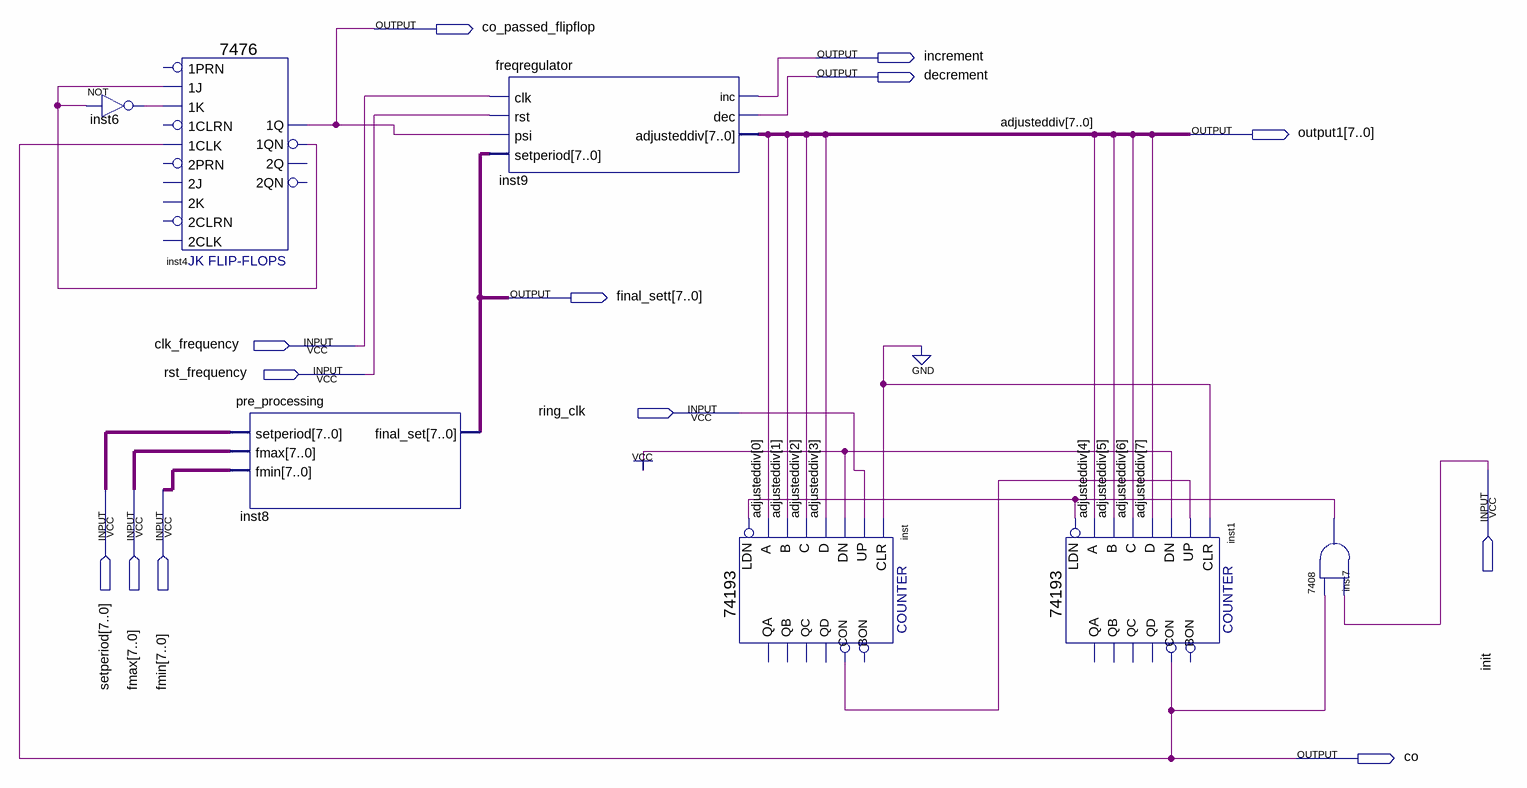
[diagram p0: schematic sheet]
// Quartus schematic frequency_requlator.bdf as structural Verilog: 7 symbols, 13 pins
module frequency_requlator (
  input  clk_frequency,
  input  rst_frequency,
  input  ring_clk,
  input  init,
  input  [7:0] setperiod,
  input  [7:0] fmax,
  input  [7:0] fmin,
  output co_passed_flipflop,
  output increment,
  output decrement,
  output [7:0] output1,
  output [7:0] final_sett,
  output co
);

  wire inst4_1qn, inst6_out, inst7_1, inst_con;

  not inst6 (inst6_out, inst4_1qn);
  \7476  inst4 (
    .\1J (inst4_1qn), .\1K (inst6_out), .\1CLK (co), .\1Q (co_passed_flipflop), .\1QN (inst4_1qn));  // open: 1PRN, 2PRN, 2J, 1CLRN, 2K, 2CLRN, 2CLK, 2QN, 2Q
  pre_processing inst8 (.setperiod(setperiod), .fmax(fmax), .fmin(fmin), .final_set(final_sett));
  freqregulator inst9 (
    .clk(clk_frequency), .rst(rst_frequency), .psi(co_passed_flipflop), .setperiod(final_sett),
    .inc(increment), .dec(decrement), .adjusteddiv(output1));
  \74193  inst (
    .D(output1[3]), .C(output1[2]), .B(output1[1]), .A(output1[0]), .CLR(1'b0), .UP(ring_clk), .DN(1'b1),
    .LDN(inst7_1), .CON(inst_con));  // open: QB, QA, QD, QC, BON
  \74193  inst1 (
    .D(output1[7]), .C(output1[6]), .B(output1[5]), .A(output1[4]), .CLR(1'b0), .UP(inst_con), .DN(1'b1),
    .LDN(inst7_1), .CON(co));  // open: QB, QA, QD, QC, BON
  \7408  inst7 (.\3 (init), .\2 (co), .\1 (inst7_1));

  // Other names for the same wires on the sheet: adjusteddiv[7:0] = output1
endmodule
